# EAGLE design bt-shield-3v3-schmitt (EAGLE 6.1)
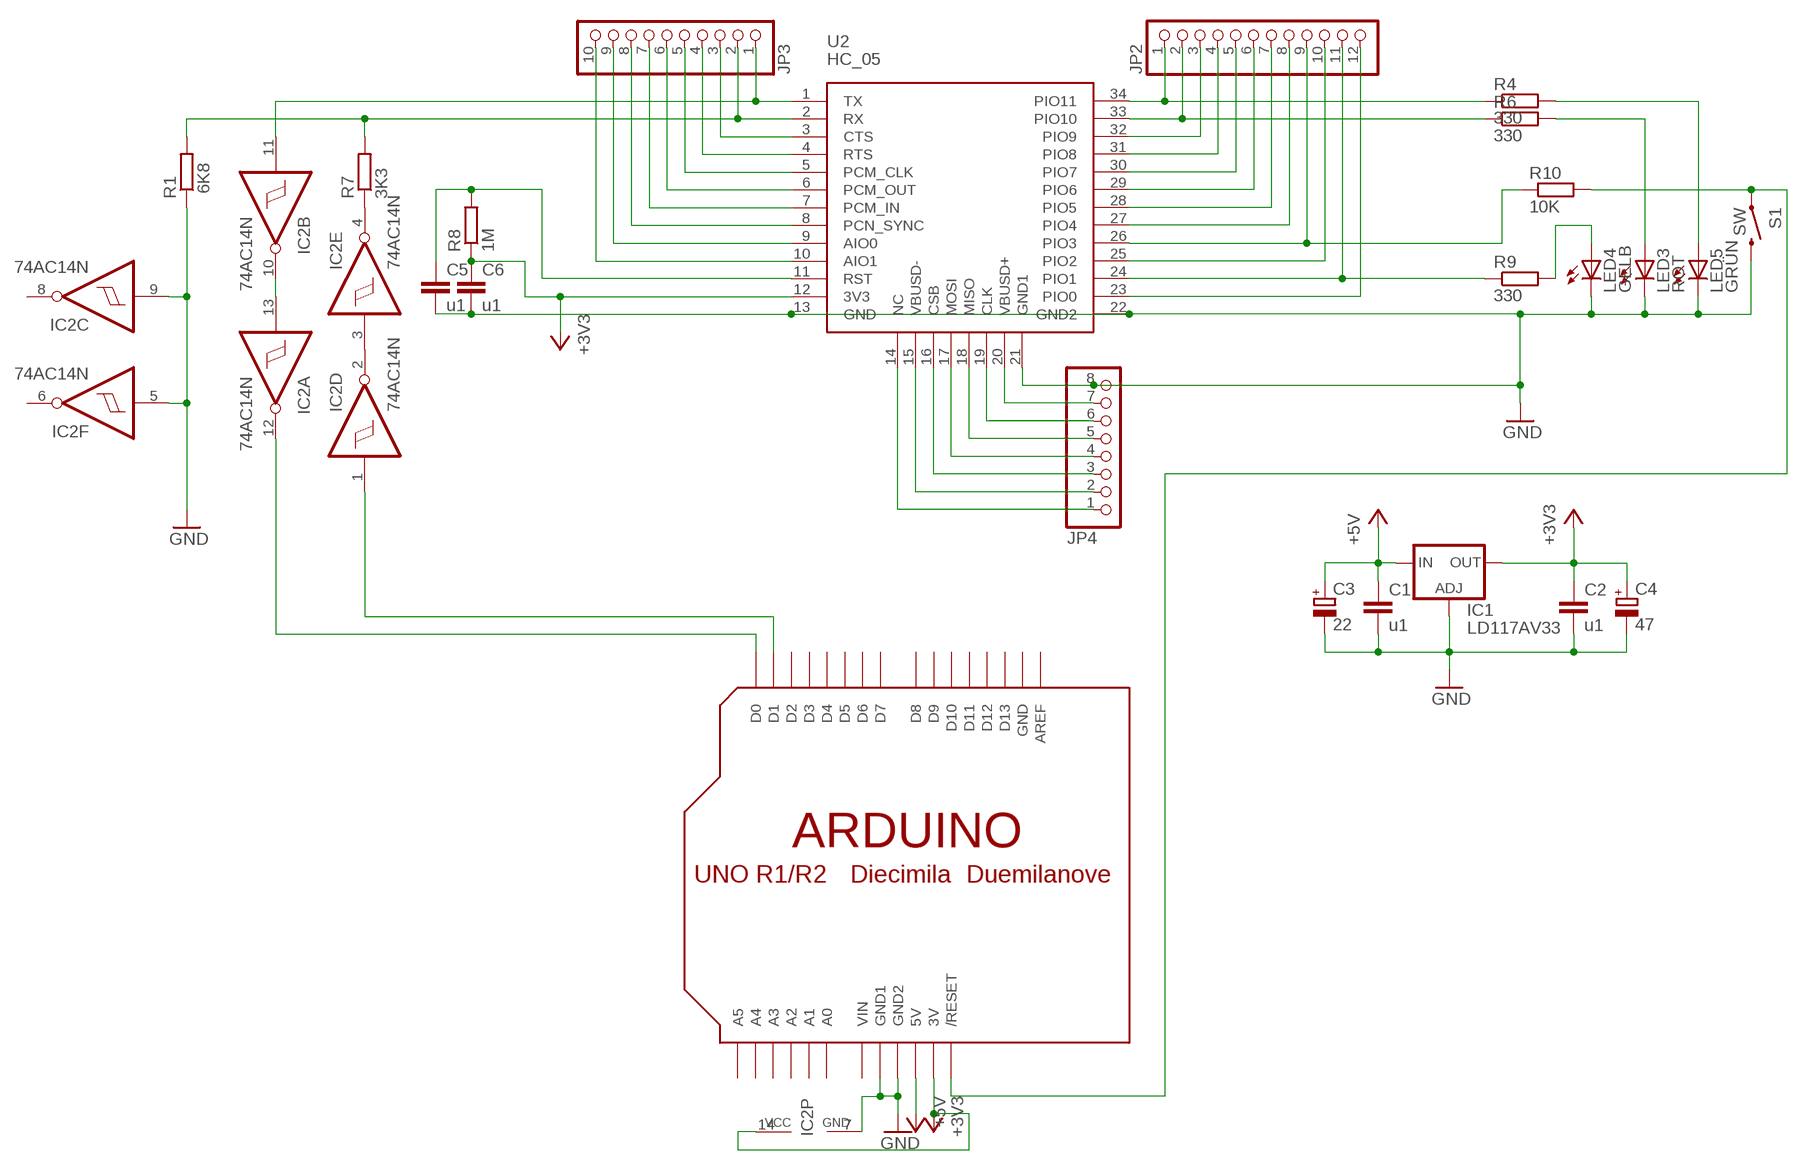
[diagram p0: schematic, sheet 1]

## Parts
C1  u1  C-EU025-025X050  [C025-025X050]
C2  u1  C-EU025-025X050  [C025-025X050]
C3  22  CPOL-EUE2.5-5  [E2,5-5]
C4  47  CPOL-EUE2.5-5  [E2,5-5]
C5  u1  C-EU025-025X050  [C025-025X050]
C6  u1  C-EU025-025X050  [C025-025X050]
IC1  LD117AV33  [TO220L1]
IC2  74AC14N  [DIL14]
JP2  PINHD-1X12  [1X12]
JP3  PINHD-1X10  [1X10]
JP4  PINHD-1X8  [1X08]
LED3  ROT  LED5MM  [LED5MM]
LED4  GELB  LED5MM  [LED5MM]
LED5  GRÜN  LED5MM  [LED5MM]
R1  6K8  R-EU_0204/7  [0204/7]
R4  330  R-EU_0207/2V  [0207/2V]
R6  330  R-EU_0207/2V  [0207/2V]
R7  3K3  R-EU_0204/7  [0204/7]
R8  1M  R-EU_0204/7  [0204/7]
R9  330  R-EU_0207/2V  [0207/2V]
R10  10K  R-EU_0207/10  [0207/10]
S1  SW  SWITCH-MOMENTARY-2PTH  [TACTILE-PTH]
U2  HC_05  [BLUETOOTH_SMD]
U$1  ARDUINO-NOHOLE  [ARDUINO-NOHOLE]

## Nets
+3V3: C2.1 C4.+ C6.1 IC1.2(OUT) IC2.14(P:VCC) R8.1 U2.12(3V3) U$1.3V
+5V: C1.1 C3.+ IC1.3(IN) U$1.5V
GND: C1.2 C2.2 C3.- C4.- C5.2 C6.2 IC1.1(ADJ) IC2.5(F:I) IC2.7(P:GND) IC2.9(C:I) JP4.8 LED3.K(C) LED4.K(C) LED5.K(C) R1.1 S1.3 U2.13(GND) U2.21(GND1) U2.22(GND2) U$1.GND1 U$1.GND2
N$1: IC2.12(A:O) U$1.D0
N$2: R10.2 S1.1 U$1.RESET(/RESET)
N$3: JP3.3 U2.3(CTS)
N$4: C5.1 R8.2 U2.11(RST)
N$5: JP2.2 R6.1 U2.33(PIO10)
N$7: JP2.1 R4.1 U2.34(PIO11)
N$8: LED3.A R6.2
N$9: LED5.A R4.2
N$10: LED4.A R9.2
N$11: JP2.11 R9.1 U2.24(PIO1)
N$12: JP2.9 R10.1 U2.26(PIO3)
N$13: JP3.4 U2.4(RTS)
N$14: IC2.10(B:O) IC2.13(A:I)
N$15: JP3.5 U2.5(PCM_CLK)
N$16: IC2.11(B:I) JP3.1 U2.1(TX)
N$17: IC2.4(E:O) R7.1
N$18: IC2.2(D:O) IC2.3(E:I)
N$19: IC2.1(D:I) U$1.D1
N$20: JP3.2 R1.2 R7.2 U2.2(RX)
N$21: JP3.6 U2.6(PCM_OUT)
N$22: JP3.7 U2.7(PCM_IN)
N$23: JP3.8 U2.8(PCN_SYNC)
N$24: JP3.9 U2.9(AIO0)
N$25: JP3.10 U2.10(AIO1)
N$26: JP2.3 U2.32(PIO9)
N$27: JP2.4 U2.31(PIO8)
N$28: JP2.5 U2.30(PIO7)
N$29: JP2.6 U2.29(PIO6)
N$30: JP2.7 U2.28(PIO5)
N$31: JP2.8 U2.27(PIO4)
N$32: JP2.10 U2.25(PIO2)
N$33: JP2.12 U2.23(PIO0)
N$34: JP4.7 U2.20(VBUSD+)
N$35: JP4.6 U2.19(CLK)
N$36: JP4.5 U2.18(MISO)
N$38: JP4.3 U2.16(CSB)
N$39: JP4.2 U2.15(VBUSD-)
N$40: JP4.1 U2.14(NC)
N$41: JP4.4 U2.17(MOSI)
Unconnected: IC2.6(F:O) IC2.8(C:O) U$1.A0 U$1.A1 U$1.A2 U$1.A3 U$1.A4 U$1.A5 U$1.AREF U$1.D2 U$1.D3 U$1.D4 U$1.D5 U$1.D6 U$1.D7 U$1.D8 U$1.D9 U$1.D10 U$1.D11 U$1.D12 U$1.D13

## Power pins joined to a net without a drawn wire
GND: U$1.GND
VIN: U$1.VIN

## Library data of the parts
C1 C2 C5 C6 = rcl:C-EU: CAPACITOR, European symbol
C3 C4 = rcl:CPOL-EU: POLARIZED CAPACITOR, European symbol
IC1 = v-reg:LD117A?*: Low drop fixed and adjustable positive voltage regulators 1 A Source: http://www.st.com/stonline/products/literature/ds/7194/ld1117axx.pdf
IC2 = 74xx-eu:74*14: Hex schmitt trigger INVERTER
JP2 = pinhead:PINHD-1X12: PIN HEADER
JP3 = pinhead:PINHD-1X10: PIN HEADER
JP4 = pinhead:PINHD-1X8: PIN HEADER
LED3-LED5 = led:LED: LED OSRAM: - CHIPLED LG R971, LG N971, LY N971, LG Q971, LY Q971, LO R971, LY R971 LH N974, LH R974 LS Q976, LO Q976, LY Q976 LO Q996 - Hyper CHIPLED LW Q18S LB Q993, LB Q99A, LB R99A - SideLED LS A670, LO A670, LY A670, LG A670, LP A670 LB A673, LV A673, LT A673, LW A673 LH A674 LY A675 LS A676, LA A676, LO A676, LY A676, LW A676 LS A679, LY A679, LG A679 - Hyper Micro SIDELED® LS Y876, LA Y876, LO Y876, LY Y876 LT Y87S - SmartLED LW L88C, LW L88S LB L89C, LB L89S, LG L890 LS L89K, LO L89K, LY L89K LS L896, LA L896, LO L896, LY L896 - TOPLED LS T670, LO T670, LY T670, LG T670, LP T670 LSG T670, LSP T670, LSY T670, LOP T670, LYG T670 LG T671, LOG T671, LSG T671 LB T673, LV T673, LT T673, LW T673 LH T674 LS T676, LA T676, LO T676, LY T676, LB T676, LH T676, LSB T676, LW T676 LB T67C, LV T67C, LT T67C, LS T67K, LO T67K, LY T67K, LW E67C LS E67B, LA E67B, LO E67B, LY E67B, LB E67C, LV E67C, LT E67C LW T67C LS T679, LY T679, LG T679 LS T770, LO T770, LY T770, LG T770, LP T770 LB T773, LV T773, LT T773, LW T773 LH T774 LS E675, LA E675, LY E675, LS T675 LS T776, LA T776, LO T776, LY T776, LB T776 LHGB T686 LT T68C, LB T68C - Hyper Mini TOPLED® LB M676 - Mini TOPLED Santana® LG M470 LS M47K, LO M47K, LY M47K Source: http://www.osram.convergy.de LUXEON: - LUMILED® LXK2-PW12-R00, LXK2-PW12-S00, LXK2-PW14-U00, LXK2-PW14-V00 LXK2-PM12-R00, LXK2-PM12-S00, LXK2-PM14-U00 LXK2-PE12-Q00, LXK2-PE12-R00, LXK2-PE12-S00, LXK2-PE14-T00, LXK2-PE14-U00 LXK2-PB12-K00, LXK2-PB12-L00, LXK2-PB12-M00, LXK2-PB14-N00, LXK2-PB14-P00, LXK2-PB14-Q00 LXK2-PR12-L00, LXK2-PR12-M00, LXK2-PR14-Q00, LXK2-PR14-R00 LXK2-PD12-Q00, LXK2-PD12-R00, LXK2-PD12-S00 LXK2-PH12-R00, LXK2-PH12-S00 LXK2-PL12-P00, LXK2-PL12-Q00, LXK2-PL12-R00 Source: www.luxeon.com KINGBRIGHT: KA-3528ASYC Source: www.kingbright.com
R1 R4 R6-R10 = rcl:R-EU_: RESISTOR, European symbol
S1 = SparkFun:SWITCH-MOMENTARY-2
U2 = SerialPortBluetooth:HC_05
U$1 = adafruit:ARDUINO: Arduino Diecimila/Duemilanove Make a shield with ease, this package has all the named pins as well as the two mounting drill holes and an outline of the USB and DC power connector. The outline is on the DIMENSION layer, so if your board house uses it they will cut the outline to match. http://www.ladyada.net/library/pcb/eaglelibrary.html

## Board
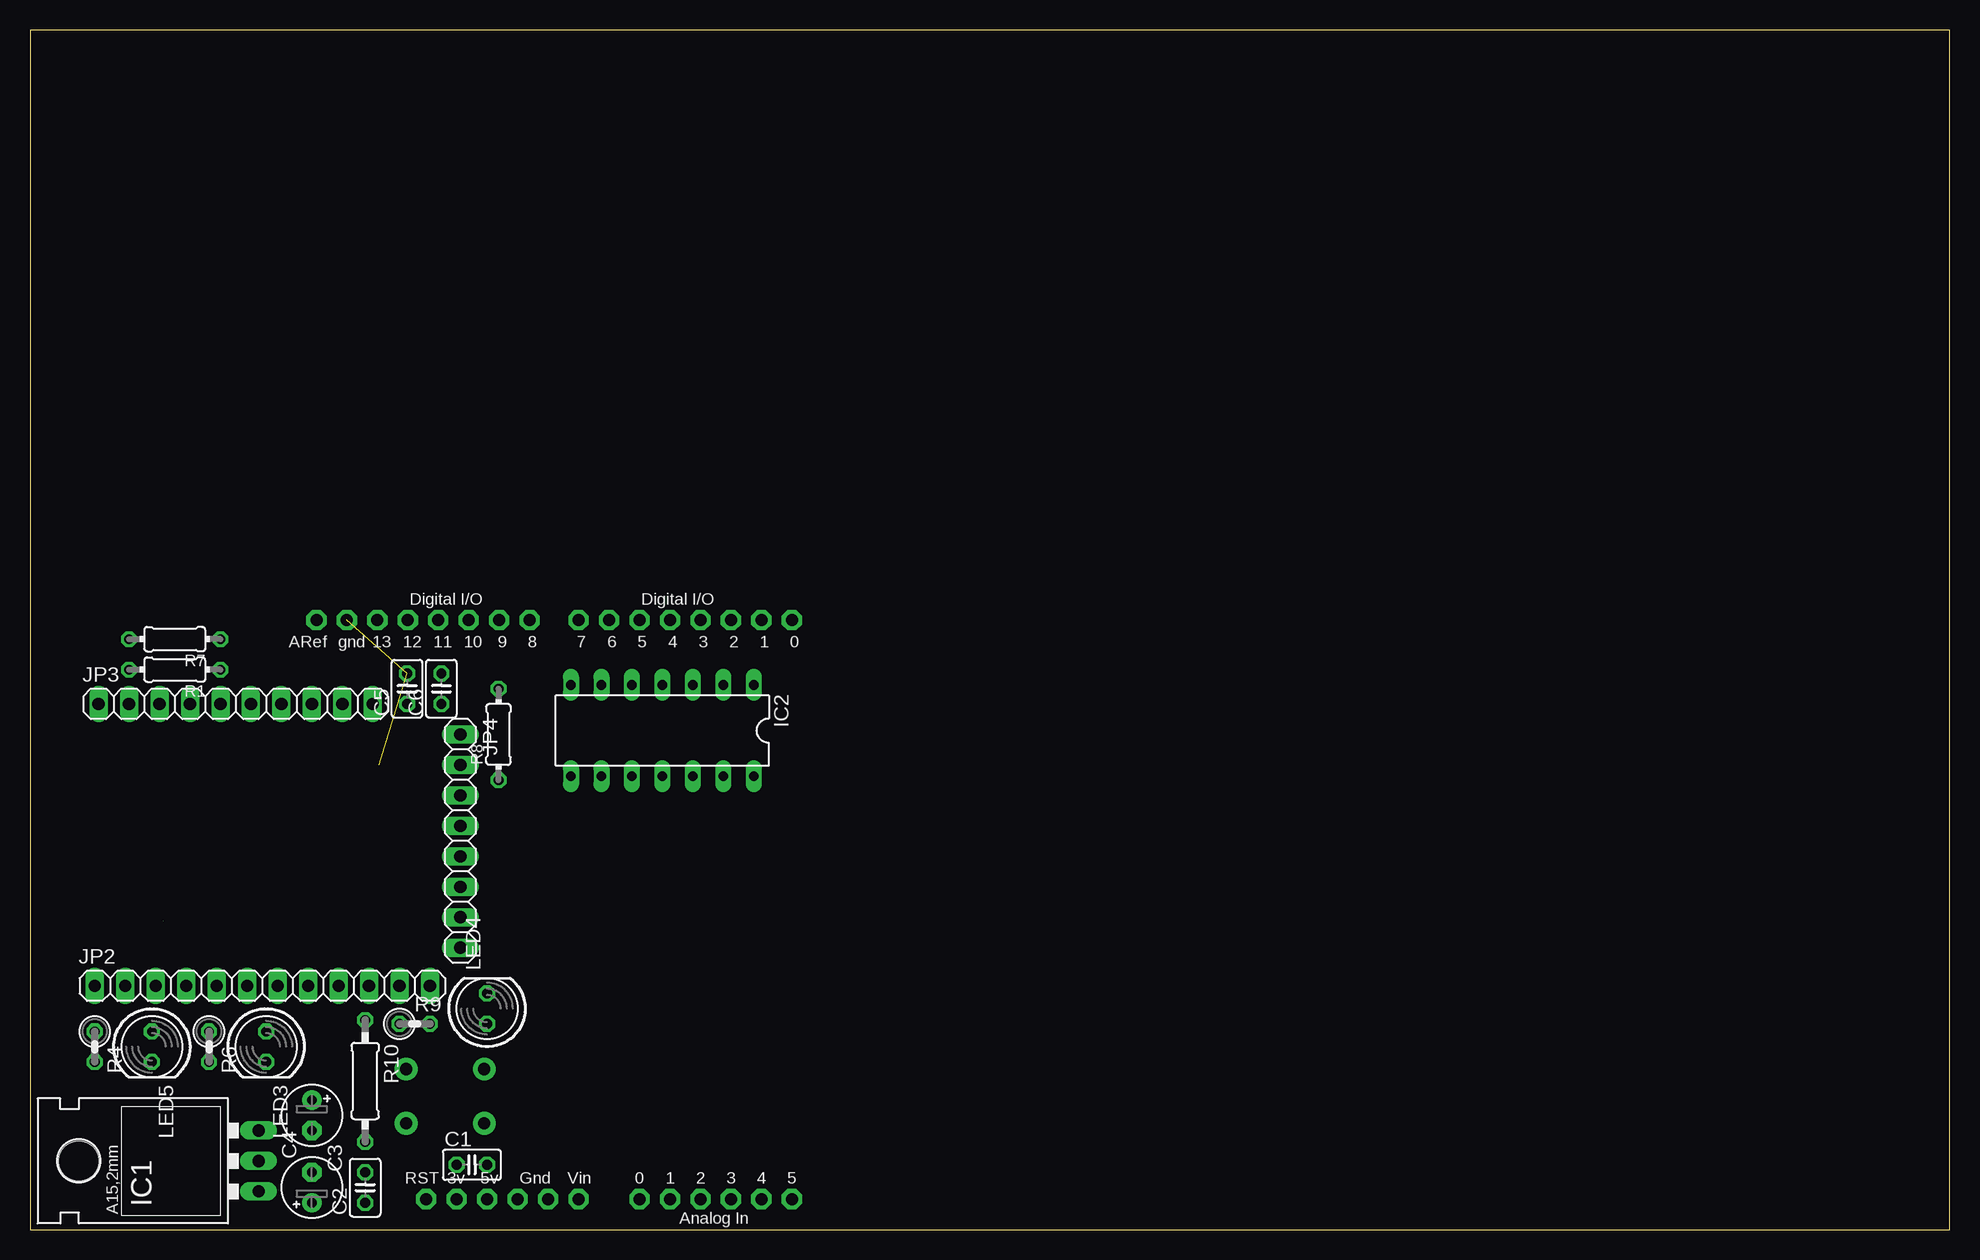
[diagram p1: board, top side]
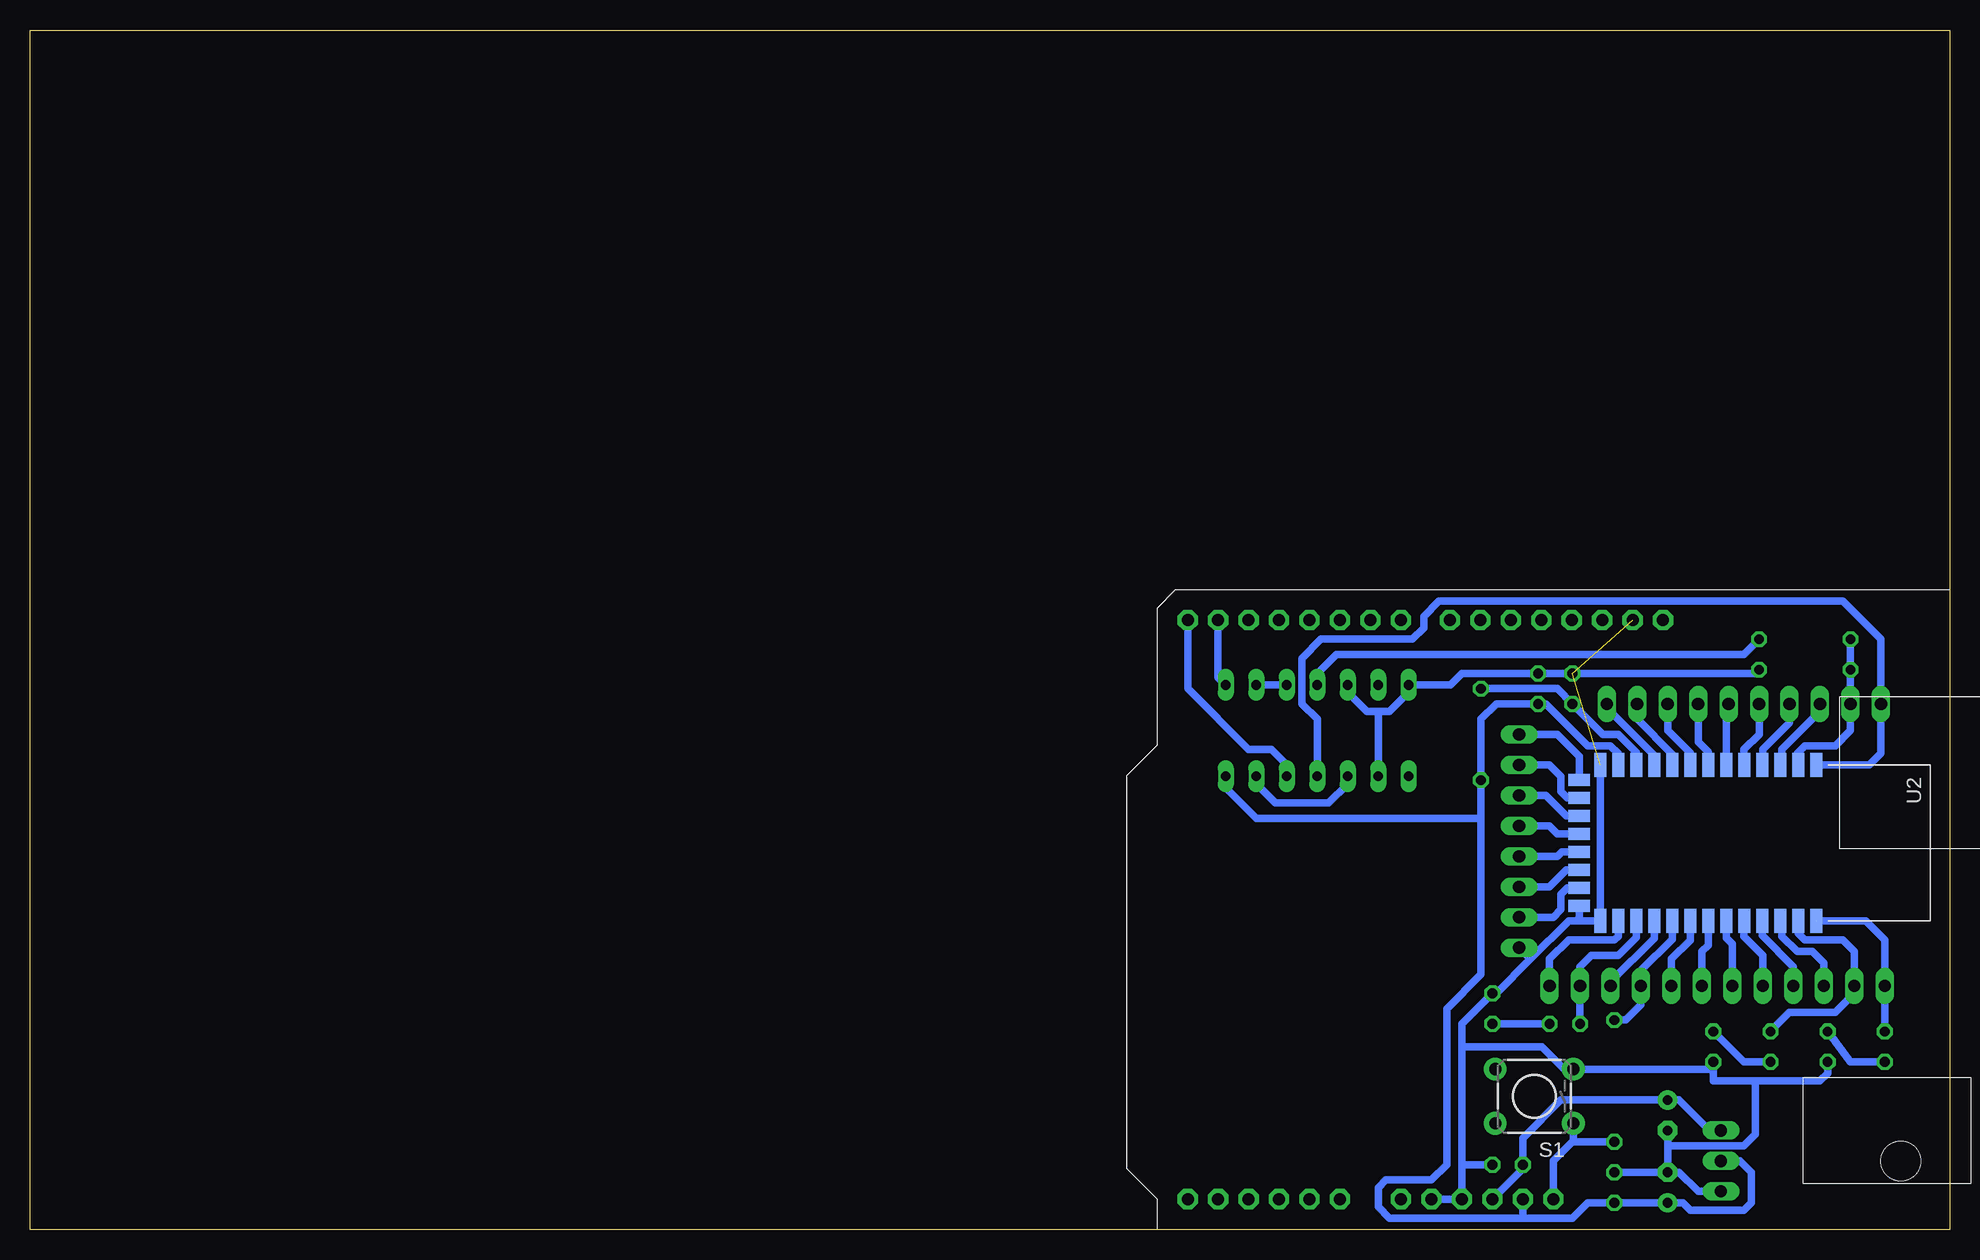
[diagram p2: board, bottom side, seen from below]

Size 160 x 100 mm. Coordinates in mm from the lower left corner, seen from the top.
Outline: 0,0 160,0 160,100 0,100 0,0
Copper layers (1*16): Top 0.035mm / dielectric 1.5mm / Bottom 0.035mm
Design rules: minimum track width 10mil, minimum drill 24mil, track to track 8mil, track to pad 8mil, pad to pad 8mil, via to via 8mil, smd to smd 8mil, copper to edge 40mil, drill to drill 8mil, minimum pad ring 10mil, minimum via ring 8mil, stop-mask expansion 4mil, vias tented up to drill 0mil, thermal gap 10mil

### Footprints (pad centres in the part's own frame; a part is rotated, then mirrored left to right if it is on the bottom)
C025-025X050 = drill 0.813 octagon: 1 -1.27,0; 2 1.27,0
E2,5-5 = drill 0.813 pad 1.6: + -1.27,0 | drill 0.813 pad 1.6 octagon: - 1.27,0
TO220L1 = drill 1.016 long: 1 -2.54,-3.81; 2 0,-3.81; 3 2.54,-3.81 | hole 3.302: 0,11.176
DIL14 = drill 0.813 long: 1 -7.62,-3.81; 2 -5.08,-3.81; 3 -2.54,-3.81; 4 0,-3.81; 5 2.54,-3.81; 6 5.08,-3.81; 7 7.62,-3.81; 8 7.62,3.81; 9 5.08,3.81; 10 2.54,3.81; 11 0,3.81; 12 -2.54,3.81; 13 -5.08,3.81; 14 -7.62,3.81
1X12 = drill 1.016 long: 1 -13.97,0; 2 -11.43,0; 3 -8.89,0; 4 -6.35,0; 5 -3.81,0; 6 -1.27,0; 7 1.27,0; 8 3.81,0; 9 6.35,0; 10 8.89,0; 11 11.43,0; 12 13.97,0
1X10 = drill 1.016 long: 1 -11.43,0; 2 -8.89,0; 3 -6.35,0; 4 -3.81,0; 5 -1.27,0; 6 1.27,0; 7 3.81,0; 8 6.35,0; 9 8.89,0; 10 11.43,0
1X08 = drill 1.016 long: 1 -8.89,0; 2 -6.35,0; 3 -3.81,0; 4 -1.27,0; 5 1.27,0; 6 3.81,0; 7 6.35,0; 8 8.89,0
LED5MM = drill 0.813 octagon: A -1.27,0; K 1.27,0
0204/7 = drill 0.813 octagon: 1 -3.81,0; 2 3.81,0
0207/2V = drill 0.813 octagon: 1 -1.27,0; 2 1.27,0
0207/10 = drill 0.813 octagon: 1 -5.08,0; 2 5.08,0
TACTILE-PTH = drill 1.016 pad 1.88: 1 -3.251,2.261; 2 3.251,2.261; 3 -3.251,-2.261; 4 3.251,-2.261
BLUETOOTH_SMD = smd 2 x 1: 1 0,0; 2 0,-1.5; 3 0,-3; 4 0,-4.5; 5 0,-6; 6 0,-7.5; 7 0,-9; 8 0,-10.5; 9 0,-12; 10 0,-13.5; 11 0,-15; 12 0,-16.5; 13 0,-18; 22 13,-18; 23 13,-16.5; 24 13,-15; 25 13,-13.5; 26 13,-12; 27 13,-10.5; 28 13,-9; 29 13,-7.5; 30 13,-6; 31 13,-4.5; 32 13,-3; 33 13,-1.5; 34 13,0 | smd 1 x 1.8: 14 1.25,-19.75; 15 2.75,-19.75; 16 4.25,-19.75; 17 5.75,-19.75; 18 7.25,-19.75; 19 8.75,-19.75; 20 10.25,-19.75; 21 11.75,-19.75
ARDUINO-NOHOLE = drill 1 pad 1.676 octagon: 3V 35.56,2.54; 5V 38.1,2.54; A0 50.8,2.54; A1 53.34,2.54; A2 55.88,2.54; A3 58.42,2.54; A4 60.96,2.54; A5 63.5,2.54; AREF 23.876,50.8; D0 63.5,50.8; D1 60.96,50.8; D2 58.42,50.8; D3 55.88,50.8; D4 53.34,50.8; D5 50.8,50.8; D6 48.26,50.8; D7 45.72,50.8; D8 41.656,50.8; D9 39.116,50.8; D10 36.576,50.8; D11 34.036,50.8; D12 31.496,50.8; D13 28.956,50.8; GND 26.416,50.8; GND1 43.18,2.54; GND2 40.64,2.54; RESET 33.02,2.54; VIN 45.72,2.54

### Placement (x,y rotation side)
C1  36.83,5.4 0 top
C2  27.94,3.49 90 top
C3  23.5,9.53 270 top
C4  23.5,3.49 90 top
C5  31.43,45.09 90 top
C6  34.29,45.09 90 top
IC1  15.24,5.71 90 top
IC2  52.7,41.59 180 top
JP2  19.37,20.32 0 top
JP3  17.14,43.81 0 top
JP4  35.88,32.38 270 top
LED3  19.68,15.24 270 top
LED4  38.1,18.41 90 top
LED5  10.16,15.24 270 top
R1  12.06,46.67 180 top
R4  5.4,15.24 270 top
R6  14.92,15.24 270 top
R7  12.06,49.21 180 top
R8  39.05,41.27 90 top
R9  32.07,17.14 0 top
R10  27.94,12.38 270 top
S1  34.61,11.11 180 bottom
U2  11.11,38.73 270 bottom
U$1  0,0 0 top

### Tracks (layer width: path | path; a pad name or v marks a point on that pad's centre or on a via)
+3V3
  Bottom 0.61: IC1.2 17.46,5.71 16.51,4.76 16.51,2.22 17.14,1.59 21.59,1.59 22.23,2.22 C4.+ C2.1 30.16,2.22 31.43,0.95 35.56,0.95 | U$1.3V 35.56,0.95 | U2.12 27.61,39.68 28.26,40.32 30.16,40.32 33.66,43.81 C6.1 37.78,43.81 39.05,42.55 R8.1 39.05,34.29 | 35.56,0.95 46.67,0.95 47.62,1.91 47.62,3.49 46.99,4.13 43.18,4.13 41.91,5.4 41.91,18.41 39.05,21.27 39.05,34.29 | IC2.14 60.33,36.83 57.78,34.29 39.05,34.29
+5V
  Bottom 0.61: U$1.5V 35.56,5.08 C1.1 35.56,7.62 32.38,10.79 C3.+ 22.54,10.79 20,8.26 IC1.3
GND  (2 unrouted)
  Bottom 0.61: 31.11,25.73 U2.22 U2.13 29.11,35.88 | 31.11,25.73 31.73,25.73 34.92,22.54 | U2.21 30.86,25.99 31.11,25.73 | LED5.K 10.16,13.02 10.79,12.38 16.19,12.38 | 16.19,12.38 19.68,12.38 19.68,13.34 | LED3.K 19.68,13.34 | JP4.8 34.92,22.54 | IC1.1 20.95,3.17 22.54,4.76 C4.- | U$1.GND1 U$1.GND2 40.64,5.4 | C4.- 23.5,6.99 | 23.5,6.99 17.14,6.99 16.19,7.94 16.19,12.38 | 23.5,6.99 C3.- C4.- | 34.92,22.54 37.78,19.68 LED4.K 40.64,17.14 40.64,15.24 | C2.2 C4.- | 19.68,13.34 19.72,13.37 S1.3 32.11,13.37 33.97,15.24 40.64,15.24 | C1.2 40.64,5.4 | 40.64,5.4 40.64,15.24 | R1.1 16.19,46.35 C5.2 C6.2 40.64,46.35 41.59,45.4 IC2.7 45.09,44.77 46.67,43.18 47.62,43.18 | 47.62,43.18 IC2.9 | 47.62,43.18 48.58,43.18 50.16,44.77 IC2.5
N$1
  Bottom 0.61: IC2.12 55.24,38.73 56.52,40.01 58.42,40.01 63.5,45.09 U$1.D0
N$2
  Bottom 0.61: R10.2 31.43,7.3 | 31.43,7.3 33.02,5.71 U$1.RESET | S1.1 31.36,7.38 31.43,7.3
N$3
  Bottom 0.61: JP3.3 10.79,43.18 13.97,40.01 13.97,38.88 U2.3
N$4
  Bottom 0.61: U2.11 26.11,39.77 27.62,41.27 28.89,41.27 C5.1 32.7,45.09 R8.2
N$5
  Bottom 0.61: U2.33 12.61,24.68 12.06,24.13 8.89,24.13 7.94,23.18 JP2.2 7.94,19.68 9.53,18.1 13.34,18.1 R6.1
N$7  (1 unrouted)
  Bottom 0.61: 11.11,25.72 6.99,25.72 5.4,24.13 JP2.1 R4.1
N$8
  Bottom 0.61: R6.2 17.14,13.97 LED3.A
N$9
  Bottom 0.61: R4.2 8.26,13.97 LED5.A
N$10
  Bottom 0.61: R9.2 LED4.A
N$11
  Bottom 0.61: U2.24 26.11,24.37 27.62,22.86 29.84,22.86 30.8,21.91 JP2.11 R9.1
N$12
  Bottom 0.61: U2.26 23.11,24.2 25.72,21.59 JP2.9 25.72,18.73 26.99,17.46 R10.1
N$13
  Bottom 0.61: JP3.4 13.34,42.23 15.56,40.01 15.56,38.79 U2.4
N$14
  Bottom 0.61: IC2.10 50.16,37.15 51.75,35.56 56.2,35.56 57.78,37.15 IC2.13
N$15
  Bottom 0.61: JP3.5 15.88,41.27 17.14,40.01 17.14,38.77 U2.5
N$16
  Bottom 0.61: JP3.1 5.71,39.69 6.67,38.73 U2.1 | 5.71,46.99 JP3.1 | JP3.1 5.71,49.21 8.89,52.39 42.55,52.39 43.81,51.12 43.81,50.16 44.77,49.21 52.39,49.21 53.98,47.62 53.98,43.81 52.7,42.55 IC2.11
N$17
  Bottom 0.61: R7.1 17.14,47.94 51.12,47.94 52.7,46.35 IC2.4
N$18
  Bottom 0.61: IC2.3 IC2.2
N$19
  Bottom 0.61: IC2.1 60.96,46.04 U$1.D1
N$20
  Bottom 0.61: U2.2 12.7,38.82 12.7,39.69 12.06,40.32 9.53,40.32 8.26,41.59 JP3.2 8.26,46.35 R1.2 R7.2
N$21
  Bottom 0.61: U2.6 18.61,42.98 18.41,43.18 JP3.6
N$22
  Bottom 0.61: U2.7 20.11,39.8 20.95,40.64 JP3.7
N$23
  Bottom 0.61: U2.8 21.61,39.71 23.5,41.59 JP3.8
N$24
  Bottom 0.61: U2.9 23.11,39.62 26.04,42.55 JP3.9
N$25
  Bottom 0.61: U2.10 24.61,39.53 28.57,43.5 JP3.10
N$26
  Bottom 0.61: U2.32 13.97,25.59 13.97,24.45 12.7,23.18 11.43,23.18 10.48,22.23 JP2.3
N$27
  Bottom 0.61: U2.31 15.61,24.5 13.02,21.91 JP2.4
N$28
  Bottom 0.61: U2.30 17.14,25.7 17.14,24.45 15.56,22.86 JP2.5
N$29
  Bottom 0.61: U2.29 18.61,24.33 18.1,23.81 JP2.6
N$30
  Bottom 0.61: U2.28 20.11,23.7 20.64,23.18 JP2.7
N$31
  Bottom 0.61: U2.27 21.61,24.11 23.18,22.54 JP2.8
N$32
  Bottom 0.61: U2.25 24.61,24.28 28.26,20.64 JP2.10
N$33
  Bottom 0.61: U2.23 27.61,24.46 27.94,24.13 31.75,24.13 33.34,22.54 JP2.12
N$34
  Bottom 0.61: U2.20 31.84,28.48 32.38,27.94 32.38,26.67 33.02,26.04 JP4.7
N$35
  Bottom 0.61: U2.19 31.93,29.98 33.34,28.57 JP4.6
N$36
  Bottom 0.61: U2.18 32.33,31.48 32.7,31.11 JP4.5
N$38
  Bottom 0.61: U2.16 31.95,34.48 33.66,36.2 JP4.3
N$39
  Bottom 0.61: U2.15 31.86,35.98 32.38,36.51 32.38,37.78 33.34,38.73 JP4.2
N$40
  Bottom 0.61: U2.14 30.86,39.44 32.7,41.27 JP4.1
N$41
  Bottom 0.61: U2.17 32.67,32.98 33.34,33.66 JP4.4